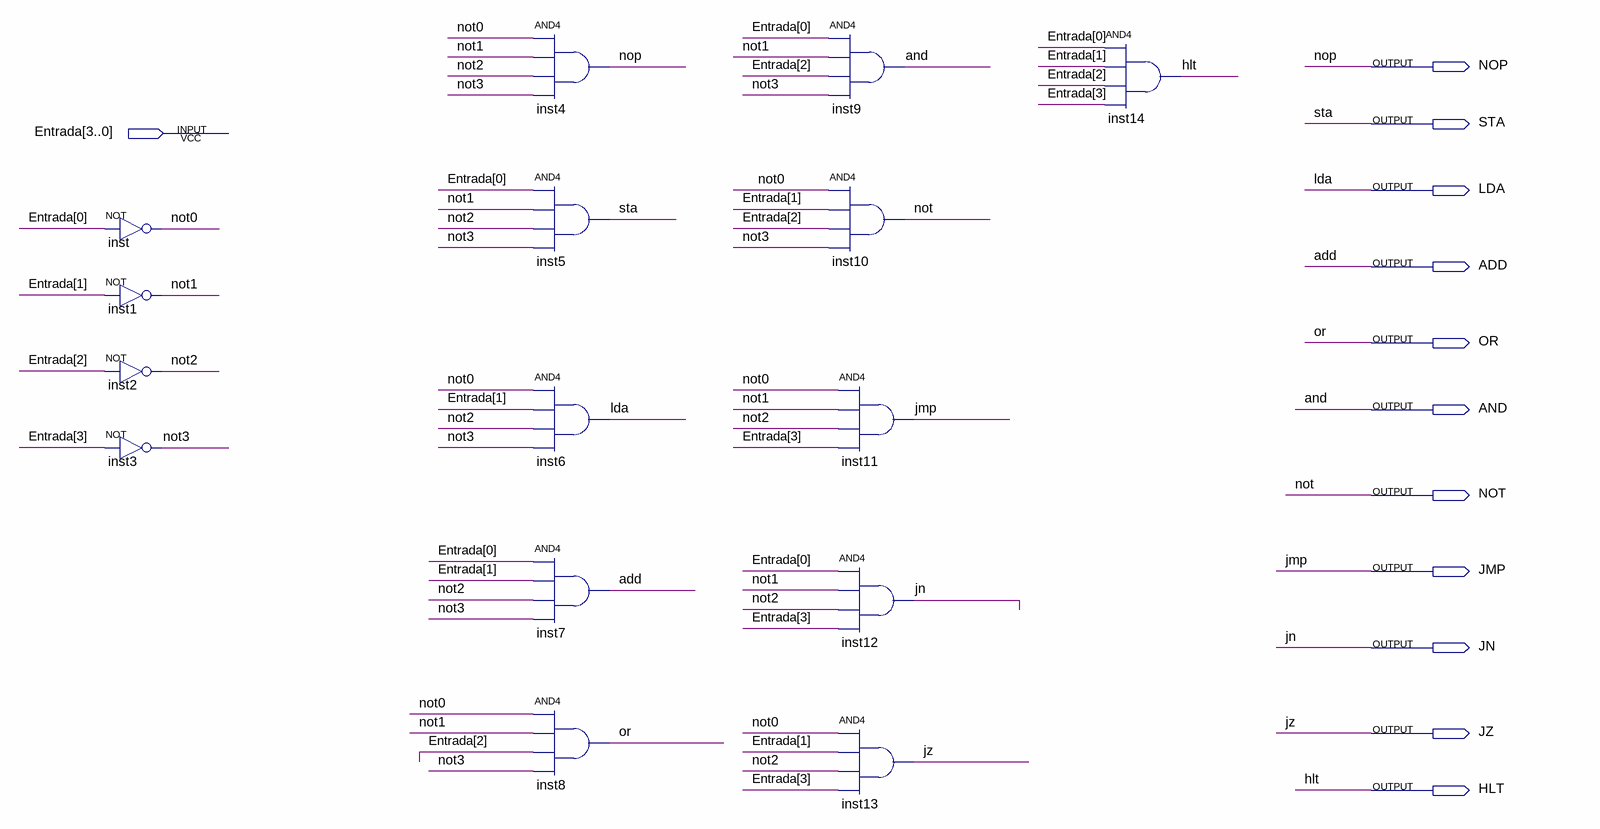
[diagram p0: schematic sheet]
// Quartus schematic DECODER_4p11.bdf as structural Verilog: 15 symbols, 12 pins
module DECODER_4p11 (
  input  [3:0] Entrada,
  output NOP,
  output STA,
  output LDA,
  output ADD,
  output OR,
  output AND,
  output NOT,
  output JMP,
  output JN,
  output JZ,
  output HLT
);

  wire not0, not1, not2, not3;

  not inst (not0, Entrada[0]);
  not inst1 (not1, Entrada[1]);
  not inst2 (not2, Entrada[2]);
  not inst3 (not3, Entrada[3]);
  and inst4 (NOP, not0, not1, not2, not3);
  and inst5 (STA, Entrada[0], not1, not2, not3);
  and inst6 (LDA, not0, Entrada[1], not2, not3);
  and inst7 (ADD, Entrada[0], Entrada[1], not2, not3);
  and inst8 (OR, not0, not1, Entrada[2], not3);
  and inst9 (AND, Entrada[0], not1, Entrada[2], not3);
  and inst10 (NOT, not0, Entrada[1], Entrada[2], not3);
  and inst11 (JMP, not0, not1, not2, Entrada[3]);
  and inst12 (JN, Entrada[0], not1, not2, Entrada[3]);
  and inst13 (JZ, not0, Entrada[1], not2, Entrada[3]);
  and inst14 (HLT, Entrada[0], Entrada[1], Entrada[2], Entrada[3]);
endmodule
